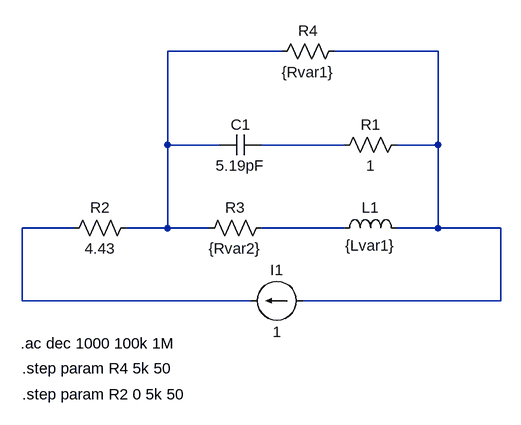
[diagram p0: schematic LossResistanceOfInductor.asc]
LossResistanceOfInductor.asc, the LTspice schematic file:
Version 4
SHEET 1 880 680
WIRE 224 -80 48 -80
WIRE 464 -80 304 -80
WIRE 48 64 48 -80
WIRE 128 64 48 64
WIRE 320 64 192 64
WIRE 464 64 464 -80
WIRE 464 64 400 64
WIRE -96 192 -176 192
WIRE 48 192 48 64
WIRE 48 192 -16 192
WIRE 112 192 48 192
WIRE 320 192 192 192
WIRE 464 192 464 64
WIRE 464 192 400 192
WIRE 560 192 464 192
WIRE -176 304 -176 192
WIRE 176 304 -176 304
WIRE 560 304 560 192
WIRE 560 304 256 304
SYMBOL res 416 48 R90
WINDOW 0 0 56 VBottom 2
WINDOW 3 32 56 VTop 2
SYMATTR InstName R1
SYMATTR Value 1
SYMBOL cap 192 48 R90
WINDOW 0 0 32 VBottom 2
WINDOW 3 32 32 VTop 2
SYMATTR InstName C1
SYMATTR Value 5.19pF
SYMBOL res 0 176 R90
WINDOW 0 0 56 VBottom 2
WINDOW 3 32 56 VTop 2
SYMATTR InstName R2
SYMATTR Value 4.43
SYMBOL res 208 176 R90
WINDOW 0 0 56 VBottom 2
WINDOW 3 32 56 VTop 2
SYMATTR InstName R3
SYMATTR Value {Rvar2}
SYMBOL res 320 -96 R90
WINDOW 0 0 56 VBottom 2
WINDOW 3 32 56 VTop 2
SYMATTR InstName R4
SYMATTR Value {Rvar1}
SYMBOL ind 304 208 R270
WINDOW 0 32 56 VTop 2
WINDOW 3 5 56 VBottom 2
SYMATTR InstName L1
SYMATTR Value {Lvar1}
SYMBOL current 256 304 R90
WINDOW 0 -32 40 VBottom 2
WINDOW 3 32 40 VTop 2
SYMATTR InstName I1
SYMATTR Value 1
TEXT -178 370 Left 2 !.ac dec 1000 100k 1M
TEXT -176 408 Left 2 !.step param R4 5k 50
TEXT -176 448 Left 2 !.step param R2 0 5k 50

The netlist it stands for:
* LossResistanceOfInductor.asc
R1 N002 N003 1
C1 N003 N001 5.19pF
R2 N001 N004 4.43
R3 N005 N001 {Rvar2}
R4 N002 N001 {Rvar1}
L1 N005 N002 {Lvar1}
I1 N002 N004 1
.ac dec 1000 100k 1M
.step param R4 5k 50
.step param R2 0 5k 50
.backanno
.end